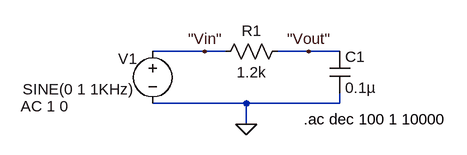
[diagram p0: schematic Low Pass.asc]
Low Pass.asc, the LTspice schematic file:
Version 4
SHEET 1 880 680
WIRE 80 -272 0 -272
WIRE 112 -272 80 -272
WIRE 240 -272 192 -272
WIRE 288 -272 240 -272
WIRE 144 -192 0 -192
WIRE 288 -192 288 -208
WIRE 288 -192 144 -192
WIRE 144 -160 144 -192
FLAG 240 -272 "Vout"
FLAG 144 -160 0
FLAG 80 -272 "Vin"
SYMBOL res 208 -288 R90
WINDOW 0 0 56 VBottom 2
WINDOW 3 32 56 VTop 2
SYMATTR InstName R1
SYMATTR Value 1.2k
SYMBOL cap 272 -272 R0
SYMATTR InstName C1
SYMATTR Value 0.1µ
SYMBOL voltage 0 -288 R0
WINDOW 0 -53 27 Left 2
WINDOW 3 -200 74 Left 2
WINDOW 123 -203 100 Left 2
SYMATTR InstName V1
SYMATTR Value SINE(0 1 1KHz)
SYMATTR Value2 AC 1 0
TEXT 232 -168 Left 2 !.ac dec 100 1 10000

The netlist it stands for:
* Low Pass.asc
R1 "Vout" "Vin" 1.2k
C1 "Vout" 0 0.1µ
V1 "Vin" 0 SINE(0 1 1KHz) AC 1 0
.ac dec 100 1 10000
.backanno
.end

* Results of the author's LTspice run, read from the files saved beside the schematic
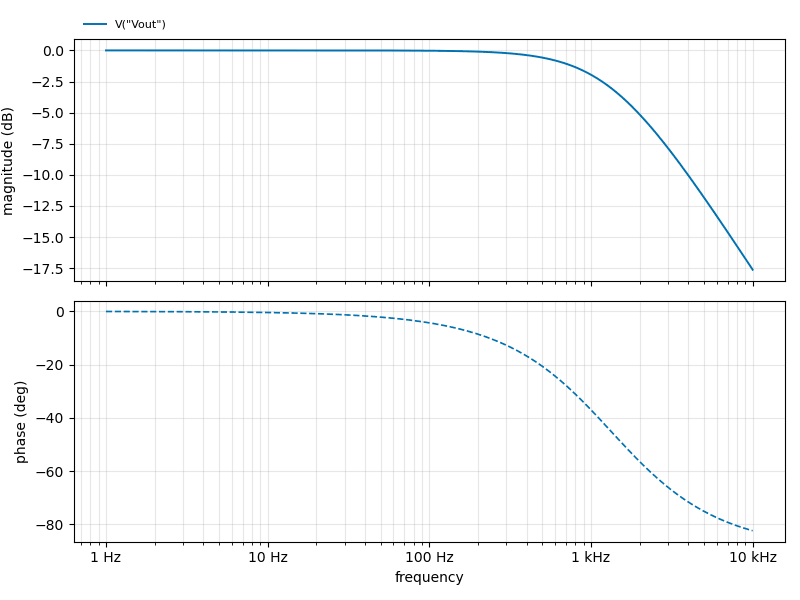
[diagram p1: AC Analysis of Low Pass.asc, plotted from the saved traces]
* AC Analysis, 1 run:
*   V("Vout"): -0.00 dB at 1 Hz, -17.62 dB at 10 kHz, peak -0.00 dB at 1 Hz, 3 dB below the peak at 1.326 kHz